# Altium schematic sheet top.SchDoc
size A4; SheetNumber: 1; SheetTotal: 1
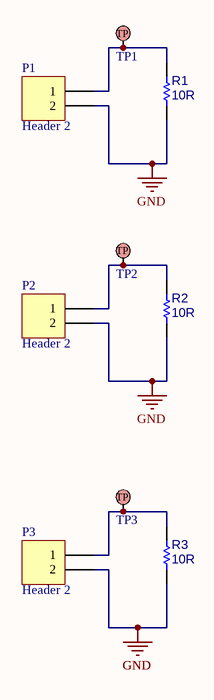
[diagram p0: top.SchDoc]

## Parts
P1  Header 2  [HDR1X2]
P2  Header 2  [HDR1X2]
P3  Header 2  [HDR1X2]
R1  10R  [0805[2012]]
R2  10R  [0805[2012]]
R3  10R  [0805[2012]]
TP1  Single Pin Test Point  [testpoint_SMD]  (value not drawn)  (no BOM)
TP2  Single Pin Test Point  [testpoint_SMD]  (value not drawn)  (no BOM)
TP3  Single Pin Test Point  [testpoint_SMD]  (value not drawn)  (no BOM)

## Nets
GND: P1.2 P2.2 P3.2 R1.1 R2.1 R3.1
NetP1_1: P1.1 R1.2 TP1.0
NetP2_1: P2.1 R2.2 TP2.0
NetP3_1: P3.1 R3.2 TP3.0

## Notes on the sheet
- (in symbol Testpoint) TP

## Library data of the parts
P1-P3 = Header 2: Header, 2-Pin; LatestRevisionDate: 17-Jul-2002; LatestRevisionNote: Re-released for DXP Platform.; Publisher: Altium Limited
R1-R3 = Res: Resistor; Manufacturer: *; MPN: *; Package: *; Price (USD): *; ComponentLink1Description: Datasheet; ComponentLink1URL: *; ComponentLink2Description: SupplierLink; ComponentLink2URL: *
TP1-TP3 = Testpoint: ComponentLink1Description: Datasheet; ComponentLink2Description: SupplierLink